# Altium schematic sheet Sheet1.SchDoc
size A4; SheetNumber: 1; SheetTotal: 1; SPICEModelCacheGXHMMMLC: <root> / <DocumentId>GXHMMMLC</DocumentId> / </root>
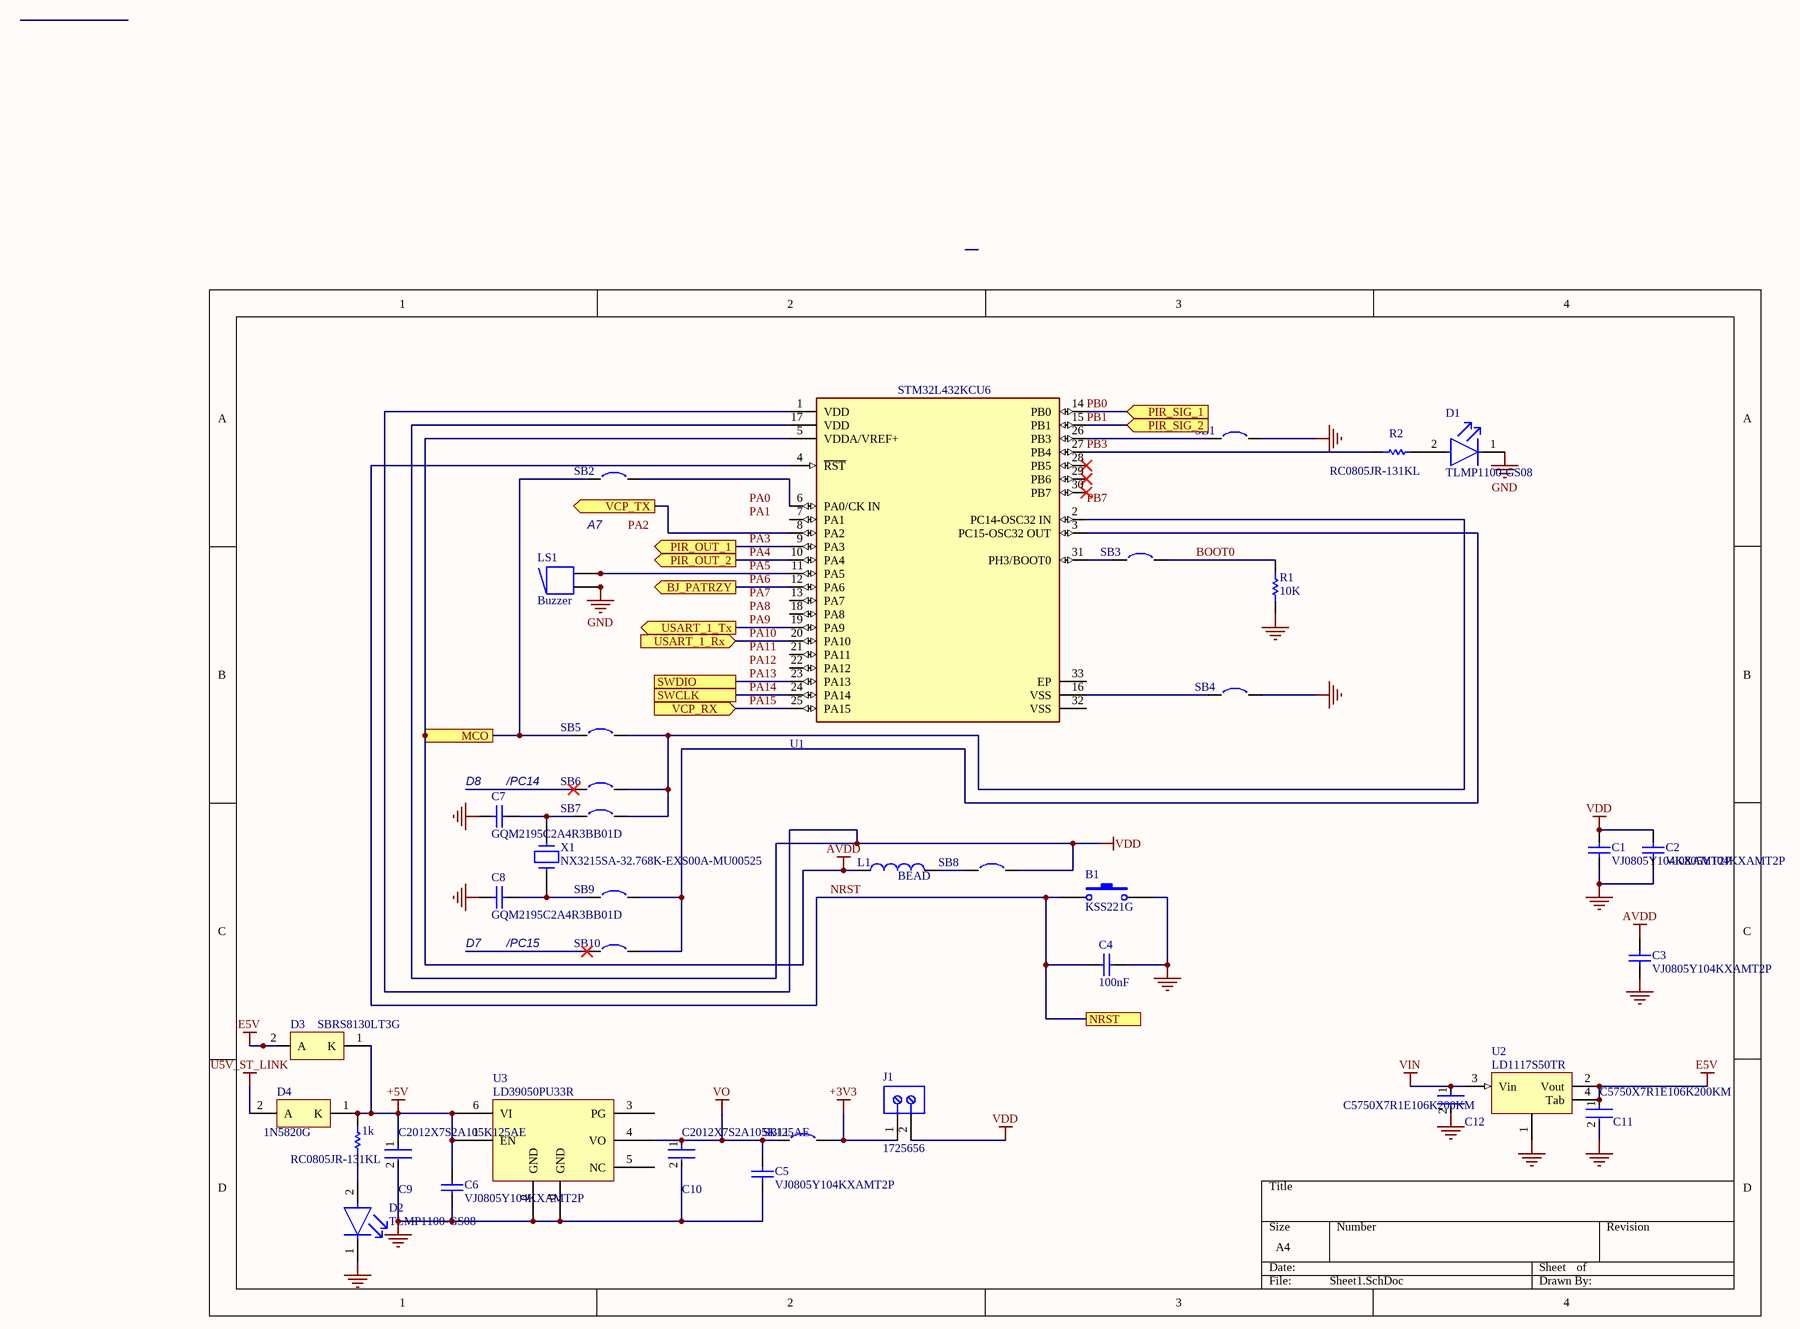
[diagram p0: Sheet1.SchDoc]

## Parts
1k  RC0805JR-131KL  [RESC2013X60X35ML10T20]
B1  KSS221G  [SW2_5R6_5R5x3R1]
C1  VJ0805Y104KXAMT2P  [CAPC2013X145X48NL20T23]
C2  VJ0805Y104KXAMT2P  [CAPC2013X145X48NL20T23]
C3  VJ0805Y104KXAMT2P  [CAPC2013X145X48NL20T23]
C4  100nF  [0603C]
C5  VJ0805Y104KXAMT2P  [CAPC2013X145X48NL20T23]
C6  VJ0805Y104KXAMT2P  [CAPC2013X145X48NL20T23]
C7  GQM2195C2A4R3BB01D  [CAPC2013X100X45LL15T25]
C8  GQM2195C2A4R3BB01D  [CAPC2013X100X45LL15T25]
C9  C2012X7S2A105K125AE  [FP-C2012-125-IPC_B]
C10  C2012X7S2A105K125AE  [FP-C2012-125-IPC_B]
C11  C5750X7R1E106K200KM  [FP-C5750-200-0_4-IPC_A]
C12  C5750X7R1E106K200KM  [FP-C5750-200-0_4-IPC_A]
D1  TLMP1100-GS08  [FP-6_541-5056_01-4-MFG]
D2  TLMP1100-GS08  [FP-6_541-5056_01-4-MFG]
D3  SBRS8130LT3G  [ONSC-SMB-2-403A-03_H_V]
D4  1N5820G  [ONSC-AXIAL_LEAD-2-267-05_V]
J1  1725656  [PHOE-1725656-2]
L1  BEAD  [0603L]
LS1  Buzzer  [ABSM-1574]
R1  10K  [0603R]
R2  RC0805JR-131KL  [RESC2013X60X35ML10T20]
SB1  Circuit Breaker (close)  [SB_0603]  (value not drawn)
SB2  Circuit Breaker (open)  [SB_0603]  (value not drawn)
SB3  Circuit Breaker (close)  [SB_0603]  (value not drawn)
SB4  Circuit Breaker (close)  [SB_0603]  (value not drawn)
SB5  Circuit Breaker (open)  [SB_0603]  (value not drawn)
SB6  Circuit Breaker  [SB_0603]  (value not drawn)
SB7  Circuit Breaker  [SB_0603]  (value not drawn)
SB8  Circuit Breaker (close)  [SB_0603]  (value not drawn)
SB9  Circuit Breaker  [SB_0603]  (value not drawn)
SB10  Circuit Breaker  [SB_0603]  (value not drawn)
SB11  Circuit Breaker (close)  [SB_0603]  (value not drawn)
U1  STM32L432KCU6  [FP-UFQFPN32-A0B8-IPC_C]
U2  LD1117S50TR  [SOT-223]
U3  LD39050PU33R  [DFN6_0R95_3x3_TP]
X1  NX3215SA-32.768K-EXS00A-MU00525  [XTAL_2SM_3R2X1R5]

## Ports
BJ_PATRZY (out), MCO, NRST, PIR_OUT_1 (out), PIR_OUT_2 (out), PIR_SIG_1 (in), PIR_SIG_2 (in), SWCLK, SWDIO, USART_1_Rx (in), USART_1_Tx (out), VCP_RX (in), VCP_TX (out)

## Nets
+3V3: J1.1 SB11.2
+5V: 1k.2 C6.2 C9.1 D3.1(K) D4.1(K) U3.1(EN) U3.6(VI)
AVDD: C3.2 L1.1 SB2.1 SB5.1 U1.5(VDDA/VREF+) ; port MCO
E5V: C11.1 D3.2(A) U2.2(Vout) U2.4(Tab)
GND: B1.2 C1.1 C2.1 C3.1 C4.1 C5.1 C6.1 C7.1 C8.1 C9.2 C10.2 C11.2 C12.2 D1.1(C) D2.1(C) LS1.1 LS1.1A R1.2 SB1.2 SB4.2 U2.1 U3.0(GND) U3.2(GND)
U5V_ST_LINK: D4.2(A)
VDD: C1.2 C2.2 J1.2 SB8.2 U1.1(VDD) U1.17(VDD)
VIN: C12.1 U2.3(Vin)
VO: C5.2 C10.1 SB11.1 U3.4(VO)
BOOT0: R1.1 SB3.2
NRST: B1.1 C4.2 U1.4(~{RST}) ; port NRST
PA3: U1.9(PA3) ; port PIR_OUT_1
PA4: U1.10(PA4) ; port PIR_OUT_2
PA5: LS1.2 LS1.2A U1.11(PA5)
PA6: U1.12(PA6) ; port BJ_PATRZY
PA9: U1.19(PA9) ; port USART_1_Tx
PA10: U1.20(PA10) ; port USART_1_Rx
PA13: U1.23(PA13) ; port SWDIO
PA14: U1.24(PA14) ; port SWCLK
PA15: U1.25(PA15) ; port VCP_RX
PB0: U1.14(PB0) ; port PIR_SIG_1
PB1: U1.15(PB1) ; port PIR_SIG_2
PB3: R2.1 U1.27(PB4)
VCP_TX: U1.8(PA2) ; port VCP_TX
Net1k_1: 1k.1 D2.2(A)
NetC7_2: C7.2 SB7.1 X1.1
NetC8_2: C8.2 SB9.1 X1.2
NetD1_2: D1.2(A) R2.2
NetL1_2: L1.2 SB8.1
NetSB1_1: SB1.1 U1.26(PB3)
NetSB2_2: SB2.2 U1.6(PA0/CK_IN)
NetSB3_1: SB3.1 U1.31(PH3/BOOT0)
NetSB4_1: SB4.1 U1.16(VSS)
NetSB5_2: SB5.2 SB6.2 SB7.2 U1.2(PC14-OSC32_IN)
NetSB9_2: SB9.2 SB10.2 U1.3(PC15-OSC32_OUT)

Not connected (* = marked no-connect by the designer): SB6 1*; SB10 1*; U1 7(PA1) 13(PA7) 18(PA8) 21(PA11) 22(PA12) 28(PB5)* 29(PB6)* 30(PB7)* 32(VSS) 33(EP); U3 3(PG) 5(NC)

## Notes on the sheet
- A7
- (near C7) D8
- (near C7) /PC14
- (near C8) D7
- /PC15
- Labels drawn without touching a wire or pin: PA0, PA1, PA2, PA7, PA8, PA11, PA12, PB7

## Library data of the parts
1k R2 = CMP-2001-01418-1: Manufacturer: Yageo; Part Number: RC0805JR-131KL
B1 = SW-PB: Switch; Published: 24-Mar-1999; LatestRevisionDate: 17-Jul-2002; LatestRevisionNote: Re-released for DXP Platform.; PackageReference: SPST-2; Publisher: Altium Limited
C1-C3 C5 C6 = CMP-2007-02027-1: Manufacturer: Vishay; Part Number: VJ0805Y104KXAMT2P
C4 = CAP: Capacitor; Value: 100pF; Published: 8-Jun-2000; Revision: July-2002: Re-released for DXP Platform.; Publisher: Altium Limited
C7 C8 = CMP-2007-03772-1: Manufacturer: Murata; Part Number: GQM2195C2A4R3BB01D
C9 C10 = CMP-08246-004333-1: CAP CER 1UF 100V X7S 0805; Tolerance: 10%; Case Code (Metric): 2012; Resistor Type: Ceramic; Voltage Rating (DC): 100V; RoHS Compliant: Yes; Mount: Surface Mount; Min Operating Temperature: -55°C; Voltage Rating: 100V; Series: C; Width: 0.05inch; Max Operating Temperature: 125°C; Height: 1.25mm; Capacitance: 1uF; Length: 2mm; Dielectric: X7S; Case/Package: 0805; Packaging: Tape and Reel; Features: Soft Termination; Lead Free: Lead Free; Case Code (Imperial): 0805; Thickness: 0.049inch; Termination: SMD/SMT; Package Quantity: 1; Depth: 1.25mm
C11 C12 = CMP-08246-006659-1: Multilayer Ceramic Capacitors 10uF ±10% 25V X7R SMD 2220; Capacitance: 10uF; Dielectric: X7R; Series: C; Voltage Rating: 25V; Weight: 0.016932oz; Mount: Surface Mount; Number of Pins: 2; Package Quantity: 1; Termination: SMD/SMT; Thickness: 0.087inch; Max Operating Temperature: 125°C; Min Operating Temperature: -55°C; Resistor Type: Ceramic; Case/Package: 2220; Height: 2.3mm; Width: 0.197inch; Case Code (Metric): 5750; REACH SVHC: No SVHC; Packaging: Tape and Reel; Tolerance: 10%; Length: 5.7mm; RoHS Compliant: Yes; Case Code (Imperial): 2220; Voltage Rating (DC): 25V; Depth: 5mm
D1 = CMP-02520-000009-1: LED GREEN 0603 SMD; Manufacturer: Vishay; Description: Green 561nm LED Indication - Discrete 2.1V 0603 (1608 Metric); Max Junction Temp: +120°C; Automotive Grade: Grade 3; Reverse Voltage: 6V; Led Orientation: Top View; Forward Voltage: 2.1V; Luminous Intensity: 15mcd; Forward Current: 20mA; Colour: Pure green; Peak Emmision Wavelength: 562nm; Wavelength: 561nm; Viewing Angle: 160°; Power Dissipation: 90mW; Digikey Description: LED GREEN 0603 SMD; Package: 6.541-5056.01-4; Ambient Temperature Range High: +100°C; Height: 0.65mm; Device Class L1: Optoelectronics; Device Class L2: LEDs; Mouser Description: Standard LEDs - SMD Pure Green; Temperature Range High: +120°C; RoHS: TRUE; Ambient Temperature Range Low: -40°C; Temperature: to +120°C; Manufacturer Part Number: TLMP1100-GS08; ComponentLink2URL: http://www.vishay.com/docs/83173/tlmb1100.pdf; Lead Free: Yes; Octopart: https://octopart.com/tlmp1100-gs08-vishay-55433993; Automotive: Yes; Device Class L3: unset; ComponentLink2Description: Datasheet; Category: Diode
D2 = CMP-02520-000009-1: LED GREEN 0603 SMD; Manufacturer: Vishay; Max Junction Temp: +120°C; Automotive Grade: Grade 3; Reverse Voltage: 6V; Led Orientation: Top View; Forward Voltage: 2.1V; Luminous Intensity: 15mcd; Forward Current: 20mA; Colour: Pure green; Peak Emmision Wavelength: 562nm; Wavelength: 561nm; Viewing Angle: 160°; Power Dissipation: 90mW; Digikey Description: LED GREEN 0603 SMD; Package: 6.541-5056.01-4; Ambient Temperature Range High: +100°C; Height: 0.65mm; Device Class L1: Optoelectronics; Device Class L2: LEDs; Mouser Description: Standard LEDs - SMD Pure Green; Temperature Range High: +120°C; RoHS: TRUE; Ambient Temperature Range Low: -40°C; Temperature: to +120°C; Manufacturer Part Number: TLMP1100-GS08; ComponentLink2URL: http://www.vishay.com/docs/83173/tlmb1100.pdf; Lead Free: Yes; Octopart: https://octopart.com/tlmp1100-gs08-vishay-55433993; Automotive: Yes; Device Class L3: unset; ComponentLink2Description: Datasheet; Category: Diode
D3 = CMP-1055-00345-1: Schottky Power Rectifier, 2-Pin SMB, Pb-Free, Tape and Reel; Manufacturer: On Semiconductor; Configuration: Single; IFSM Max (A): 40; ComponentLink1URL: http://www.onsemi.com/; RoHS: TRUE; PackageDescription: 2-Pin Small Molded Package, J-Bend Lead, Body 4.33 x 3.625 mm; ComponentLink2Description: Datasheet; ComponentLink3Description: Package Specification; DatasheetVersion: Rev. 9; Mounting Technology: Surface Mount; ComponentLink3URL: http://www.onsemi.com/pub_link/Collateral/1SMB5913BT3-D.PDF; PackageReference: SMB-2-403A-03_H; ComponentLink2URL: http://www.onsemi.cn/pub_link/Collateral/MBRS130LT3-D.PDF; Packing: Tape and Reel; ComponentLink1Description: Manufacturer URL; PartNumber: SBRS8130LT3G; PackageVersion: Rev. H, 05/2011
D4 = CMP-1055-00026-1: Rectifier, 2-Pin Axial_Lead, Pb-Free, Bulk Bag; Manufacturer: On Semiconductor; Configuration: Single; IFSM Max (A): 80; RoHS: TRUE; ComponentLink2Description: Datasheet; Packing: Bulk Bag; ComponentLink1Description: Manufacturer URL; PackageVersion: Rev. G, 06/2000; DatasheetVersion: Rev. 10; ComponentLink3URL: http://www.onsemi.com/pub_link/Collateral/267-05.PDF; ComponentLink2URL: http://www.onsemi.cn/pub_link/Collateral/1N5820-D.PDF; PartNumber: 1N5820G; ComponentLink1URL: http://www.onsemi.com/; PackageReference: AXIAL_LEAD-2-267-05; ComponentLink3Description: Package Specification; PackageDescription: 2-Pin, Axial Lead, Diameter 5.05 mm; Mounting Technology: Through Hole
J1 = CMP-2000-05299-1: Male Header, Pitch 2.54 mm, 1 x 2 Position, Height 9 mm, Tail Length 3.5 mm; Manufacturer: Phoenix Contact; Number of contacts: 2; Content: 250pc(s); Pitch: 2.54mm; Industrial packaging: Yes; Colour: Green; Manufacturer part No.: 1725656; Type: MPT0,5/2-2,54; Datasheet URL: http://datasheet.octopart.com/1725656-Phoenix-Contact-datasheet-5302866.pdf; Manufacturer URL: http://www.phoenixcontact.com/; Datasheet Version: Apr-08
L1 = Inductor: Value: 100uH; Published: 8-Jun-2000; Revision: July-2002: Re-released for DXP Platform.; Publisher: Altium Limited
LS1 = Buzzer: Magnetic Transducer Buzzer; Published: 24-Mar-1999; LatestRevisionDate: 17-Dec-2003; LatestRevisionNote: Schematic revised, PCB Footprint replaced.; DatasheetVersion: 17-Dec-2003; PackageReference: ABSM-1574; Publisher: Altium Limited; PackageDescription: Magnetic Transducer Buzzer; ComponentLink1Description: Manufacturer Link; ComponentLink1URL: http://www.megastar.com/linecard/buzzmode/index.php
R1 = res1: Resistor; Value: 1K; Published: 8-Jun-2000; Revision: July-2002: Re-released for DXP Platform.; Publisher: Altium Limited
SB1-SB11 = Circuit Breaker: Solder: NO; Published: 24-Mar-1999; Revision: July-2002: Re-released for DXP Platform.; Publisher: Altium Limited
U1 = CMP-12105-000033-1: IC MCU 32BIT 256KB FLASH 32QFPN; Manufacturer: STMicroelectronics; Max Supply Voltage: 3.6V; Number Of Timers/Counters: 11; Ram Size: 64KBytes; Number Of Usb Channels: 1; Memory Size: 256KBytes; Number Of Uart Channels: 3; Frequency: 80MHz; Number Of I2C Channels: 2; Core Architecture: ARM Cortex-M4; Number Of I/Os: 26; Min Supply Voltage: 1.62V; Data Bus Width: 32bits; Max Junction Temp: +105°C; Interface: I2C,SPI,UART,USART,CAN,USB,LIN,IrDA,Other; Ambient Temperature Range High: +85°C; Category: IC; Device Class L2: Embedded Processors and Controllers; Ambient Temperature Range Low: -40°C; Number Of Adc Channels: 11; ComponentLink2Description: Datasheet; Number Of A/D Converters: 1; Device Class L1: Integrated Circuits (ICs); Memory Type: FLASH; Height: 0.6mm; Temperature: -40°C to +105°C; Automotive: No; Temperature Range Low: -40°C; Digikey Description: IC MCU 32BIT 256KB FLASH 32QFPN; Manufacturer Part Number: STM32L432KCU6; Temperature Range High: +105°C; Octopart: https://octopart.com/stm32l432kcu6-stmicroelectronics-71093510; Device Class L3: Microcontrollers; Number Of Pwm Channels: 1; Number Of Spi Channels: 2; Lead Free: Yes; Number Of Cores: 1; Package: UFQFPN32-A0B8; ComponentLink2URL: https://www.st.com/content/ccc/resource/technical/document/datasheet/24/01/9f/59/f0/83/47/fc/DM00257205.pdf/files/DM00257205.pdf/jcr:content/translations/en.DM00257205.pdf; RoHS: TRUE
U2 = LD1117
U3 = LD39050P
X1 = CRYSTAL_32K: Crystal